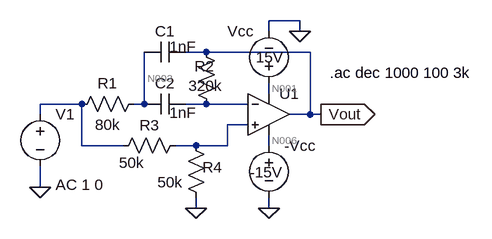
[diagram p0: schematic Q4.asc]
Q4.asc, the LTspice schematic file:
Version 4
SHEET 1 880 680
WIRE 288 0 240 0
WIRE 240 16 240 0
WIRE 288 16 288 0
WIRE 144 48 112 48
WIRE 304 48 144 48
WIRE 240 112 240 96
WIRE -48 128 -112 128
WIRE 48 128 48 48
WIRE 48 128 32 128
WIRE 144 128 112 128
WIRE 208 128 144 128
WIRE -112 144 -112 128
WIRE 304 144 304 48
WIRE 304 144 272 144
WIRE 320 144 304 144
WIRE 208 160 176 160
WIRE -48 192 -48 128
WIRE 16 192 -48 192
WIRE 128 192 96 192
WIRE 176 192 176 160
WIRE 176 192 128 192
WIRE 240 192 240 176
WIRE -112 256 -112 224
WIRE 128 288 128 272
WIRE 240 288 240 272
FLAG -112 256 0
FLAG 128 288 0
FLAG 240 288 0
FLAG 288 16 0
FLAG 320 144 Vout
IOPIN 320 144 Out
SYMBOL Opamps\\UniversalOpamp2 240 144 R0
SYMATTR InstName U1
SYMBOL voltage -112 128 R0
WINDOW 123 24 124 Left 2
WINDOW 39 0 0 Left 0
SYMATTR InstName V1
SYMATTR Value ""
SYMATTR Value2 AC 1 0
SYMBOL voltage 240 176 R0
WINDOW 3 -29 57 Left 2
SYMATTR InstName -Vcc
SYMATTR Value -15V
SYMBOL voltage 240 112 R180
WINDOW 0 24 96 Left 2
WINDOW 3 -23 56 Left 2
SYMATTR InstName Vcc
SYMATTR Value 15V
SYMBOL res 48 112 R90
WINDOW 0 0 56 VBottom 2
WINDOW 3 32 56 VTop 2
SYMATTR InstName R1
SYMATTR Value 80k
SYMBOL res 160 144 R180
WINDOW 0 4 74 Left 2
WINDOW 3 -9 44 Left 2
SYMATTR InstName R2
SYMATTR Value 320k
SYMBOL res 112 176 R90
WINDOW 0 0 56 VBottom 2
WINDOW 3 27 83 VTop 2
SYMATTR InstName R3
SYMATTR Value 50k
SYMBOL res 144 288 R180
WINDOW 0 -25 63 Left 2
WINDOW 3 36 40 Left 2
SYMATTR InstName R4
SYMATTR Value 50k
SYMBOL cap 112 32 R90
WINDOW 0 0 32 VBottom 2
WINDOW 3 -8 4 VTop 2
SYMATTR InstName C1
SYMATTR Value 1nF
SYMBOL cap 112 112 R90
WINDOW 0 0 32 VBottom 2
WINDOW 3 14 4 VTop 2
SYMATTR InstName C2
SYMATTR Value 1nF
TEXT 334 80 Left 2 !.ac dec 1000 100 3k

The netlist it stands for:
* Q4.asc
XU1 N005 N004 N001 N006 Vout level.2 Avol=1Meg GBW=10Meg Slew=10Meg ilimit=25m rail=0 Vos=0 phimargin=45 en=0 enk=0 in=0 ink=0 Rin=500Meg  ; pins IN+ IN- V+ V- OUT
V1 N002 0 AC 1 0
V§-Vcc N006 0 -15V
Vcc N001 0 15V
R1 N003 N002 80k
R2 N004 Vout 320k
R3 N005 N002 50k
R4 0 N005 50k
C1 Vout N003 1nF
C2 N004 N003 1nF
.ac dec 1000 100 3k
.lib UniversalOpamps2.sub
.backanno
.end

* Results of the author's LTspice run, read from the files saved beside the schematic
* Operating Point, zero values left out:
*   V(n001) = 15 V
*   V(n006) = -15 V
*   I(Vcc) = -1.498 mA
*   I(-vcc) = 1.498 mA
*   Ix(u1:3) = 1.498 mA
*   Ix(u1:4) = -1.498 mA
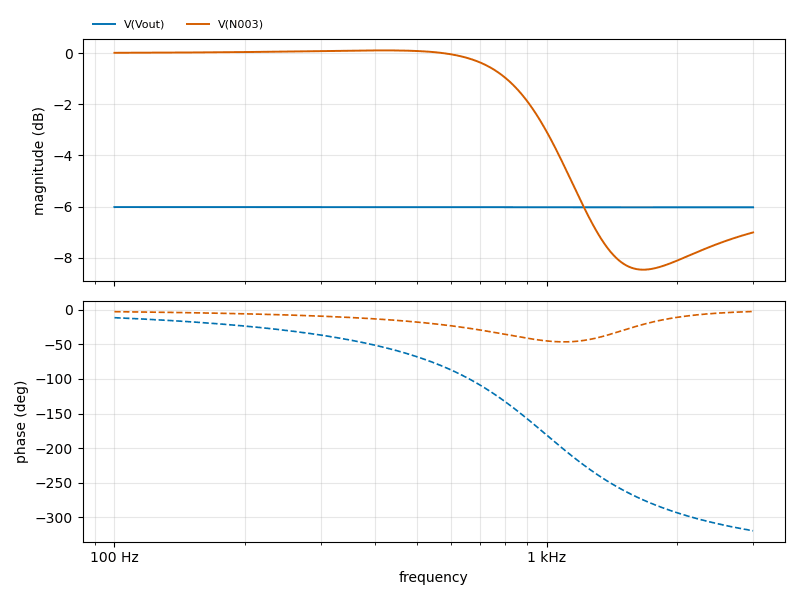
[diagram p1: AC Analysis of Q4.asc, plotted from the saved traces]
* AC Analysis, 1 run:
*   V(Vout): -6.02 dB at 100 Hz, -6.02 dB at 3 kHz, peak -6.02 dB at 100 Hz
*   V(N003): 0.01 dB at 100 Hz, -7.01 dB at 3 kHz, peak 0.10 dB at 418.8 Hz, 3 dB below the peak at 986.7 Hz